# EAGLE design AMP_UN7+T (EAGLE 6.4)
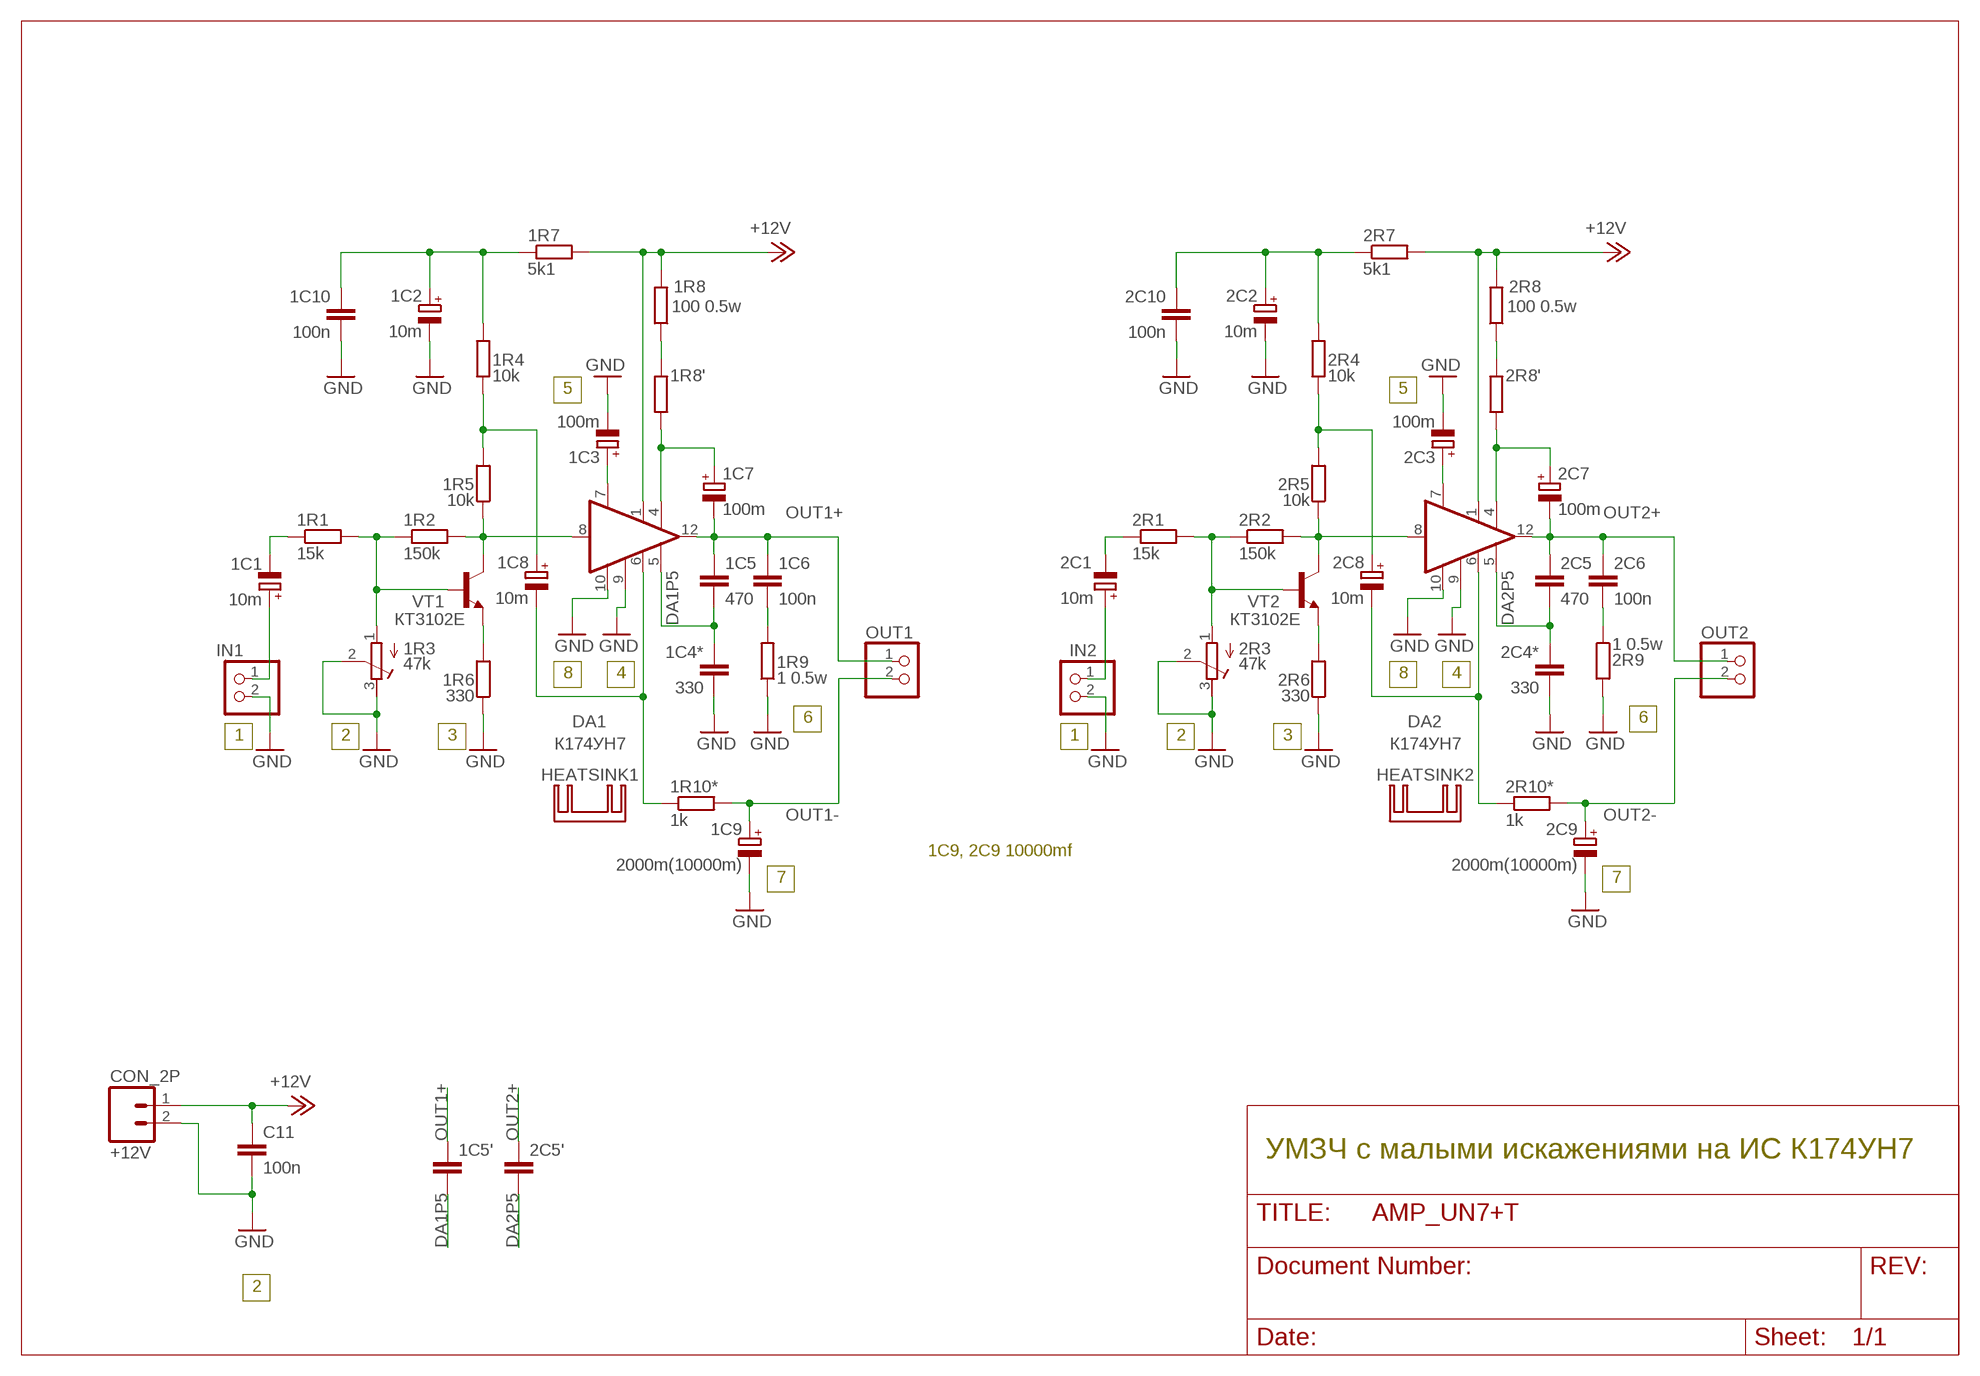
[diagram p0: schematic, sheet 1]

## Parts
1C1  10m  CPOL-EUE2.5-5  [E2,5-5]
1C2  10m  CPOL-EUE2.5-5  [E2,5-5]
1C3  100m  CPOL-EUE2.5-6  [E2,5-6]
1C4*  330  C-EU050-025X075  [C050-025X075]
1C5  470  C-EU050-030X075  [C050-030X075]
1C5'  C-EUC0805  [C0805]
1C6  100n  C-EU075-052X106  [C075-052X106]
1C7  100m  CPOL-EUE2.5-5  [E2,5-5]
1C8  10m  CPOL-EUE2.5-5  [E2,5-5]
1C9  2000m(10000m)  CPOL-EUE5-13  [E5-13]
1C10  100n  C-EUC0805  [C0805]
1R1  15k  R-EU_R0805  [R0805]
1R2  150k  R-EU_R0805  [R0805]
1R3  47k  R-TRIMM3296W  [RTRIM3296W]
1R4  10k  R-EU_R0805  [R0805]
1R5  10k  R-EU_R0805  [R0805]
1R6  330  R-EU_R0805  [R0805]
1R7  5k1  R-EU_R0805  [R0805]
1R8  100 0.5w  R-EU_R1210W  [R1210W]
1R8'  R-EU_R1210W  [R1210W]
1R9  1 0.5w  R-EU_0411/3V  [0411V]
1R10*  1k  R-EU_0207/12  [0207/12]
2C1  10m  CPOL-EUE2.5-5  [E2,5-5]
2C2  10m  CPOL-EUE2.5-5  [E2,5-5]
2C3  100m  CPOL-EUE2.5-6  [E2,5-6]
2C4*  330  C-EU050-025X075  [C050-025X075]
2C5  470  C-EU050-030X075  [C050-030X075]
2C5'  C-EUC0805  [C0805]
2C6  100n  C-EU075-052X106  [C075-052X106]
2C7  100m  CPOL-EUE2.5-5  [E2,5-5]
2C8  10m  CPOL-EUE2.5-5  [E2,5-5]
2C9  2000m(10000m)  CPOL-EUE5-13  [E5-13]
2C10  100n  C-EUC0805  [C0805]
2R1  15k  R-EU_R0805  [R0805]
2R2  150k  R-EU_R0805  [R0805]
2R3  47k  R-TRIMM3296W  [RTRIM3296W]
2R4  10k  R-EU_R0805  [R0805]
2R5  10k  R-EU_R0805  [R0805]
2R6  330  R-EU_R0805  [R0805]
2R7  5k1  R-EU_R0805  [R0805]
2R8  100 0.5w  R-EU_R1210W  [R1210W]
2R8'  R-EU_R1210W  [R1210W]
2R9  1 0.5w  R-EU_0411/3V  [0411V]
2R10*  1k  R-EU_0207/12  [0207/12]
+12V  CON_2P  [CON_PWR_2PIN4MM]
C11  100n  C-EUC0805  [C0805]
DA1  К174УН7  K174UN7  [DIL16-12]
DA2  К174УН7  K174UN7  [DIL16-12]
HEATSINK1  HEATSINK_V  [H_VELS]
HEATSINK2  HEATSINK_V  [H_VELS]
IN1  PINHD-1X2  [1X02]
IN2  PINHD-1X2  [1X02]
OUT1  PINHD-1X2  [1X02]
OUT2  PINHD-1X2  [1X02]
VT1  КТ3102Е  BJT_NPN_TO-92_CBE  [TO92]
VT2  КТ3102Е  BJT_NPN_TO-92_CBE  [TO92]

## Nets
+12V: 1R7.2 1R8.2 2R7.2 2R8.2 +12V.1 C11.1 DA1.1(1+V) DA2.1(1+V)
DA1P5: 1C4*.1 1C5'.2 1C5.2 DA1.5(5KOR)
DA2P5: 2C4*.1 2C5'.2 2C5.2 DA2.5(5KOR)
GND: 1C2.- 1C3.- 1C4*.2 1C9.- 1C10.2 1R3.2(S) 1R3.3(E) 1R6.1 1R9.1 2C2.- 2C3.- 2C4*.2 2C9.- 2C10.2 2R3.2(S) 2R3.3(E) 2R6.1 2R9.2 +12V.2 C11.2 DA1.9(9-V) DA1.10(10E) DA2.9(9-V) DA2.10(10E) IN1.2 IN2.2
IN1: 1C1.+ IN1.1
IN2: 2C1.+ IN2.1
N$1: 1R2.2 1R5.1 DA1.8(8IN) VT1.1(C)
N$2: 1R6.2 VT1.3(E)
N$3: 1R1.2 1R2.1 1R3.1(A) VT1.2(B)
N$4: 1C1.- 1R1.1
N$5: 1C8.+ 1R4.1 1R5.2
N$6: 1C2.+ 1C10.1 1R4.2 1R7.1
N$8: 1C3.+ DA1.7(7FILTR)
N$9: 1C7.+ 1R8'.1 DA1.4(4++U)
N$10: 1R8'.2 1R8.1
N$12: 1C6.2 1R9.2
N$13: 1C8.- 1R10*.1 DA1.6(6FB)
N$16: 2R2.2 2R5.1 DA2.8(8IN) VT2.1(C)
N$17: 2R6.2 VT2.3(E)
N$18: 2R1.2 2R2.1 2R3.1(A) VT2.2(B)
N$19: 2C1.- 2R1.1
N$20: 2C8.+ 2R4.1 2R5.2
N$21: 2C2.+ 2C10.1 2R4.2 2R7.1
N$22: 2C3.+ DA2.7(7FILTR)
N$23: 2C7.+ 2R8'.1 DA2.4(4++U)
N$25: 2C6.2 2R9.1
N$26: 2C8.- 2R10*.1 DA2.6(6FB)
N$28: 2R8'.2 2R8.1
OUT1+: 1C5'.1 1C5.1 1C6.1 1C7.- DA1.12(12OUT) OUT1.1
OUT1-: 1C9.+ 1R10*.2 OUT1.2
OUT2+: 2C5'.1 2C5.1 2C6.1 2C7.- DA2.12(12OUT) OUT2.1
OUT2-: 2C9.+ 2R10*.2 OUT2.2

## Notes on the sheet
- 5 | 5
- 8 | 4 | 8 | 4
- 6 | 6
- 1 | 2 | 3 | 1 | 2 | 3
- 1C9, 2C9 10000mf
- 7 | 7
- УМЗЧ с малыми искажениями на ИС К174УН7
- 2

## Library data of the parts
1C1-1C3 1C7-1C9 2C1-2C3 2C7-2C9 = rcl:CPOL-EU: POLARIZED CAPACITOR, European symbol
1C4* 1C5 1C5' 1C6 1C10 2C4* 2C5 2C5' 2C6 2C10 C11 = rcl:C-EU: CAPACITOR, European symbol
1R1 1R2 1R4-1R8 1R8' 1R9 1R10* 2R1 2R2 2R4-2R8 2R8' 2R9 2R10* = rcl:R-EU_: RESISTOR, European symbol
1R3 2R3 = rcl:R-TRIMM: Trimm resistor
+12V = untitled:CON_2P
DA1 DA2 = k174un7:K174UN7
HEATSINK1 HEATSINK2 = k174un7:HEATSINK
IN1 IN2 OUT1 OUT2 = Разъёмы штырьковые 2.54мм:PINHD-1X2: PIN HEADER
VT1 VT2 = m_transistor:BJT_NPN: NPN Transistor 13005 BCE КТ805 ECB КТ3102*М CBE МП37 ТО-5

## Board
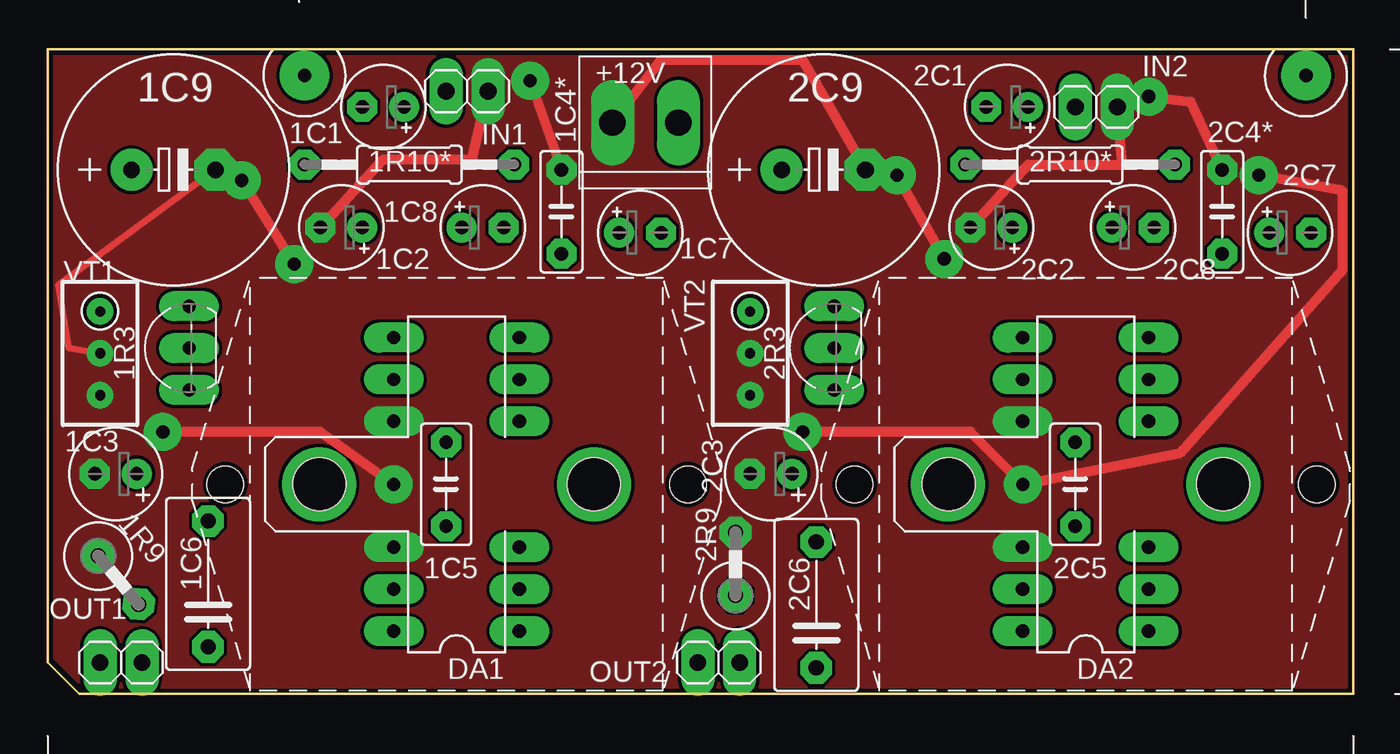
[diagram p1: board, top side]
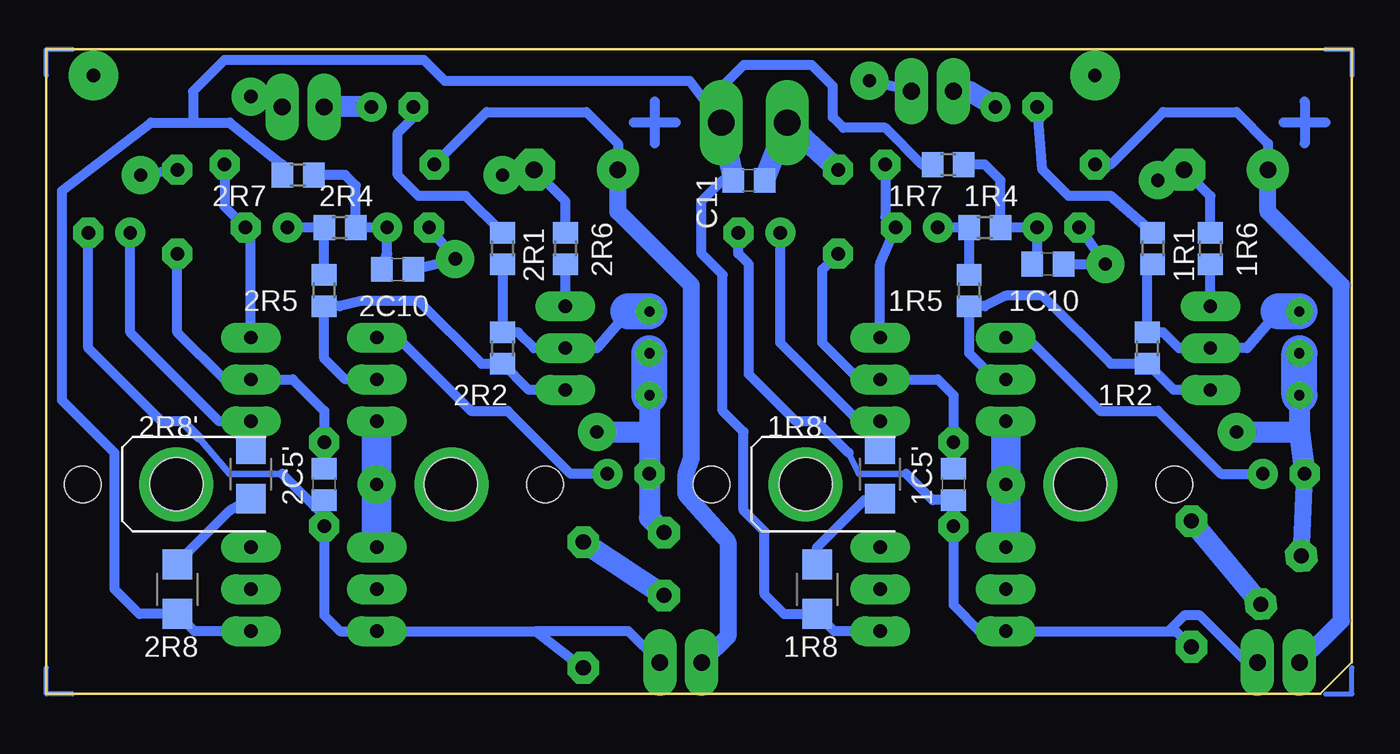
[diagram p2: board, bottom side, seen from below]

Size 79.06 x 39.05 mm. Coordinates in mm from the lower left corner, seen from the top.
Outline: 0,39.05 79.06,39.05 79.06,0 1.91,0 0,1.9 0,39.05
Copper layers (1*16): Top 0.035mm / dielectric 1.5mm / Bottom 0.035mm
Design rules "DesignRules": minimum track width 8mil, minimum drill 24mil, track to track 0.2mm, track to pad 0.2mm, pad to pad 8mil, via to via 8mil, smd to smd 8mil, copper to edge 10mil, drill to drill 8mil, minimum pad ring 0.5mm, minimum via ring 8mil, stop-mask expansion 6mil, vias tented up to drill 0mil, thermal gap 10mil

### Footprints (pad centres in the part's own frame; a part is rotated, then mirrored left to right if it is on the bottom)
E2,5-5 = drill 0.813 pad 1.6: + -1.27,0 | drill 0.813 pad 1.6 octagon: - 1.27,0
E2,5-6 = drill 0.813 pad 1.6: + -1.27,0 | drill 0.813 pad 1.6 octagon: - 1.27,0
C050-025X075 = drill 0.813 octagon: 1 -2.54,0; 2 2.54,0
C050-030X075 = drill 0.813 octagon: 1 -2.54,0; 2 2.54,0
C0805 = smd 1.3 x 1.5: 1 -0.95,0; 2 0.95,0
C075-052X106 = drill 0.914 octagon: 1 -3.81,0; 2 3.81,0
E5-13 = drill 1.016 pad 2.54: + -2.54,0 | drill 1.016 pad 2.54 octagon: - 2.54,0
R0805 = smd 1.3 x 1.5: 1 -0.95,0; 2 0.95,0
RTRIM3296W = drill 0.61: 1 0,-2.54; 2 0,0; 3 0,2.54
R1210W = smd 1.8 x 1.8: 1 -1.499,0; 2 1.499,0
0411V = drill 0.914 octagon: 1 -2.54,0; 2 1.27,0
0207/12 = drill 0.813 octagon: 1 -6.35,0; 2 6.35,0
CON_PWR_2PIN4MM = drill 1.6 long: 1 -2,0; 2 2,0
DIL16-12 = drill 0.813 long: 1 -8.89,-3.81; 2 -6.35,-3.81; 3 -3.81,-3.81; 4 3.81,-3.81; 5 6.35,-3.81; 6 8.89,-3.81; 7 8.89,3.81; 8 6.35,3.81; 9 3.81,3.81; 10 -3.81,3.81; 11 -6.35,3.81; 12 -8.89,3.81 | drill 3.2 pad 4: P$1 0,8.334; P$2 0,-8.334
H_VELS = hole 3.2: 0,8.3; 0,-8.3 | hole 2.2: 0,14; 0,-14
1X02 = drill 1.016 long: 1 -1.27,0; 2 1.27,0
TO92 = drill 0.813 long: 1 -2.54,-1.27; 2 0,-1.27; 3 2.54,-1.27

### Placement (x,y rotation side)
1C1  20.32,35.56 180 top
1C2  17.78,28.26 180 top
1C3  4.13,13.34 180 top
1C4*  31.12,29.21 90 top
1C5  24.13,12.7 90 top
1C5'  24.13,12.7 90 bottom
1C6  9.72,6.67 90 top
1C7  35.88,27.94 0 top
1C8  26.35,28.26 0 top
1C9  7.62,31.75 0 top
1C10  18.41,26.03 0 bottom
1R1  12.07,26.99 270 bottom
1R2  12.38,20.95 270 bottom
1R3  3.17,20.64 180 top
1R4  22.23,28.26 0 bottom
1R5  23.18,24.45 90 bottom
1R6  8.57,26.99 270 bottom
1R7  24.45,32.07 180 bottom
1R8  32.38,6.35 270 bottom
1R8'  28.58,13.34 270 bottom
1R9  4.7,6.41 310 top
1R10*  21.91,32.07 180 top
2C1  58.1,35.56 180 top
2C2  57.15,28.26 180 top
2C3  43.81,13.34 180 top
2C4*  71.12,29.21 90 top
2C5  62.23,12.7 90 top
2C5'  62.23,12.7 90 bottom
2C6  46.55,5.4 90 top
2C7  75.25,27.94 0 top
2C8  65.72,28.26 0 top
2C9  46.99,31.75 0 top
2C10  57.78,25.72 0 bottom
2R1  51.44,26.99 270 bottom
2R2  51.44,20.95 270 bottom
2R3  42.55,20.64 180 top
2R4  61.28,28.26 0 bottom
2R5  62.23,24.45 90 bottom
2R6  47.62,26.99 270 bottom
2R7  63.82,31.43 180 bottom
2R8  71.12,6.35 270 bottom
2R8'  66.67,13.34 270 bottom
2R9  41.66,8.51 90 top
2R10*  61.91,32.07 180 top
+12V  36.2,34.61 180 top
C11  36.51,31.12 0 bottom
DA1  24.77,12.7 90 top
DA2  62.86,12.7 90 top
HEATSINK1  24.77,12.7 90 top
HEATSINK2  62.86,12.7 90 top
IN1  25.4,36.51 0 top
IN2  63.5,35.56 0 top
OUT1  4.44,1.9 180 top
OUT2  40.64,1.9 180 top
VT1  7.3,20.95 90 top
VT2  46.36,20.95 90 top

### Tracks (layer width: path | path; a pad name or v marks a point on that pad's centre or on a via)
+12V
  Bottom 0.61: DA1.1 31.34,3.81 1R8.2 34.38,4.85 35.56,6.03 35.56,9.84 36.83,11.11 36.83,15.88 38.1,17.14 38.1,25.4 39.37,26.67 39.37,29.84 38.1,31.12 C11.1 | 1R7.2 26.04,32.07 28.26,34.29 30.8,34.29 31.43,34.92 31.43,36.83 32.7,38.1 36.83,38.1 38.51,36.42 +12V.1 40.1,37.15 54.93,37.15 56.2,38.42 68.26,38.42 70.17,36.51 70.17,34.61 | DA2.1 70.08,3.81 2R8.2 73.43,4.85 74.93,6.35 74.93,14.61 78.11,17.78 78.11,30.48 72.71,34.61 70.17,34.61 | 2R7.2 64.77,32.07 67.95,34.61 70.17,34.61
  Bottom 1.27: +12V.1 C11.1
DA1P5
  Bottom 0.61: 1C4*.1 32.07,25.72 32.07,21.27 29.84,19.05 DA1.5 25.08,19.05 24.13,18.1 1C5.2 1C5'.2
DA2P5
  Bottom 0.61: 2C4*.1 71.12,21.91 68.26,19.05 DA2.5 64.14,19.05 62.23,17.14 2C5.2 2C5'.2
GND  (via drill 0.8 pad 2.3)
  Top 0.406: 1R3.2 1.27,20.95 0.63,24.77 1C9.-
  Top 0.61: +12V.2 37.15,38.42 45.72,38.42 2C9.- | 2C4*.2 69.22,35.88 v66.67,36.2 | v14.92,26.03 v11.75,31.12 | v54.29,26.35 v51.44,31.43 | v29.21,37.15 1C4*.2 | v73.34,31.43 78.42,30.48 78.42,25.72 68.58,14.61 v59.06,12.7 55.88,15.88 v45.72,15.88 | v20.96,12.7 16.51,15.88 v6.99,15.88 | 1C2.- 20.32,32.38 25.72,32.38 IN1.2 | 2C2.- 59.37,32.07 65.09,32.07 IN2.2
  Bottom 0.61: 1R6.1 8.57,30.16 1C9.- v11.75,31.12 | 2R6.1 47.62,29.84 2C9.- v51.44,31.43 | 1C2.- v14.92,26.03 1C10.2 | 2C2.- v54.29,26.35 2C10.2 | IN1.2 v29.21,37.15 | IN2.2 v66.67,36.2 | 2C4*.2 v73.34,31.43
  Bottom 1.016: 1R9.1 1C3.-
  Bottom 1.27: 1R3.3 3.17,15.88 | 3.17,15.88 1C3.- | v6.99,15.88 3.17,15.88 | 2R3.3 42.55,15.88 | 42.55,15.88 2C3.- 42.55,10.67 2R9.2 | v45.72,15.88 42.55,15.88 | C11.2 +12V.2 1C4*.2
  Bottom 1.778: DA1.9 v20.96,12.7 DA1.10 | DA2.9 v59.06,12.7 DA2.10
  Bottom 2.184: 2R3.3 2R3.2 | 1R3.3 1R3.2
  pour Top (no thermals): 0.32,38.73 78.74,38.73 78.74,0.32 2.22,0.32 0.32,2.22
IN1
  Bottom 1.27: 1C1.+ 23.18,36.51 IN1.1
IN2
  Bottom 1.27: 2C1.+ IN2.1
N$1
  Bottom 0.61: VT1.1 10.79,18.41 1R2.2 14.61,20.01 18.73,24.13 20.96,24.13 22.22,23.5 1R5.1 23.18,20.64 21.59,19.05 DA1.8
N$2
  Bottom 0.61: VT1.3 1R6.2
N$3
  Bottom 0.61: 4.44,23.18 6.35,20.95 VT1.2 10.48,20.95 11.43,21.91 1R2.1 12.38,25.72 1R1.2
  Bottom 2.184: 1R3.1 4.44,23.18
N$4
  Bottom 0.61: 1R1.1 14.61,30.16 17.14,30.16 18.73,31.75 1C1.-
N$5
  Bottom 0.61: 1R5.2 1R4.1 1C8.+
N$6
  Bottom 0.61: 1R7.1 22.23,32.07 21.28,31.12 1R4.2 1C2.+ 19.05,26.67 1C10.1
N$7  (via drill 0.8 pad 3)
  other vias: 76.2,37.46
N$8
  Bottom 0.61: DA1.7 19.69,21.59 15.24,17.14 11.75,17.14 7.94,13.34 1C3.+
N$9
  Bottom 0.406: 1R8'.1 DA1.4
  Bottom 0.61: DA1.4 29.84,16.51 34.61,21.27 1C7.+
N$10
  Bottom 0.61: 1R8.1 32.38,8.89 29.53,11.75 1R8'.2
N$11
  Bottom 0.305: 1.59,39.05 0,39.05 0,37.46
N$12
  Bottom 1.27: 1C6.2 1R9.2
N$13
  Bottom 0.61: DA1.6 28.58,26.03 1C8.- 28.26,28.89 1R10*.1
N$14
  Bottom 0.61: 2.86,34.61 4.13,34.61 | 2.86,35.88 2.86,34.61 | 2.86,34.61 2.86,33.34 | 1.59,34.61 2.86,34.61
N$15  (via drill 0.8 pad 3)
  other vias: 15.56,37.46
N$16
  Bottom 0.61: DA2.8 60.96,19.05 62.23,20.32 2R5.1 61.28,23.5 60.01,23.81 56.52,23.81 52.71,20.01 2R2.2 49.84,18.41 VT2.1
N$17
  Bottom 0.61: VT2.3 2R6.2
N$18
  Bottom 0.61: 51.44,26.35 2R1.2 2R2.1 50.48,21.91 49.53,20.95 VT2.2 45.72,20.95 43.81,23.18
  Bottom 2.184: 2R3.1 43.81,23.18
N$19
  Bottom 0.61: 2R1.1 53.66,30.16 56.52,30.16 57.78,31.43 57.78,33.97 56.83,34.92 2C1.-
N$20
  Bottom 0.61: 2R5.2 2R4.1 2C8.+
N$21
  Bottom 0.61: 2R7.1 60.96,31.43 60.33,30.8 2R4.2 2C2.+ 58.42,26.67 2C10.1
N$22
  Bottom 0.61: DA2.7 57.78,21.59 53.34,17.14 51.12,17.14 47.31,13.34 2C3.+
N$23
  Bottom 0.406: 2R8'.1 DA2.4
  Bottom 0.61: DA2.4 68.58,16.51 73.98,21.91 2C7.+
N$24
  Bottom 0.305: 1.59,0 0,0 0,1.59
N$25
  Bottom 1.27: 2C6.2 2R9.1
N$26
  Bottom 0.61: DA2.6 66.67,28.26 2C8.- 68.26,29.53 2R10*.1
N$27
  Bottom 0.305: 77.47,0 79.06,0 79.06,1.59
N$28
  Bottom 0.61: 2R8.1 71.12,7.94 67.95,11.11 2R8'.2
N$29
  Bottom 0.305: 79.06,37.46 79.06,39.05 77.47,39.05
N$30
  Bottom 0.61: 42.23,35.88 42.23,34.61 | 42.23,34.61 42.23,33.34 | 42.23,34.61 43.5,34.61 | 40.96,34.61 42.23,34.61
OUT1+
  Bottom 0.406: 30.48,14.61 29.84,13.34 26.99,13.34
  Bottom 0.61: 11.11,3.81 DA1.12 22.54,3.81 24.13,5.4 1C5.1 1C5'.1 | 11.11,3.81 10.67,3.81 1C6.1 | 30.48,14.61 32.38,16.51 33.66,16.51 36.51,19.37 36.51,26.03 37.15,26.67 1C7.- | OUT1.1 6.35,1.9 9.21,4.76 10.16,4.76 11.11,3.81 | 1C5'.1 | 1C5'.1 25.4,11.75 26.99,13.34
OUT1-
  Bottom 0.61: 1C9.+ 5.08,33.34 6.99,35.24 11.43,35.24 14.61,32.07 1R10*.2
  Bottom 1.016: 1C9.+ 5.08,29.21 0.63,24.77 0.63,4.45 OUT1.2
OUT2+
  Bottom 0.406: 69.85,15.56 67.95,13.34 64.77,13.34
  Bottom 0.61: 69.85,15.56 70.8,16.51 72.07,16.51 76.52,20.95 2C7.- | 62.39,10.95 62.23,10.79 2C5.1 62.23,4.76 61.28,3.81 DA2.12 49.4,3.81 | 62.39,10.95 64.77,13.34 | 49.4,3.81 2C6.1 | OUT2.1 43.81,3.81 49.4,3.81 | 2C5'.1 62.23,11.11 62.39,10.95
OUT2-
  Bottom 0.61: 2R10*.2 52.39,35.24 46.36,35.24 44.45,33.34 2C9.+
  Bottom 1.016: 2C9.+ 44.45,29.21 40.01,24.77 40.01,14.29 40.32,13.34 40.32,12.06 37.78,9.21 37.78,3.49 OUT2.2